# EAGLE schematic Easel_Edge_Connnector_Minimal (EAGLE 9.5.2)
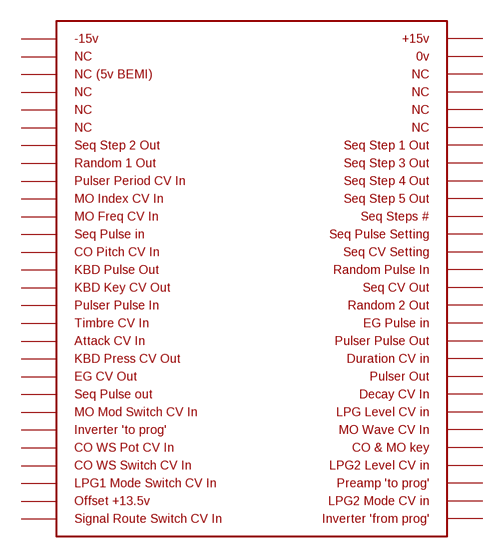
[diagram p0: schematic, sheet 1]

## Parts
U$1  EASEL_EDGESMALL  [EASEL_EDGE_SMALL]
Unconnected: U$1.B$1 U$1.B$2 U$1.B$3 U$1.B$4 U$1.B$5 U$1.B$6 U$1.B$7 U$1.B$8 U$1.B$9 U$1.B$10 U$1.B$11 U$1.B$12 U$1.B$13 U$1.B$14 U$1.B$15 U$1.B$16 U$1.B$17 U$1.B$18 U$1.B$19 U$1.B$20 U$1.B$21 U$1.B$22 U$1.B$23 U$1.B$24 U$1.B$25 U$1.B$26 U$1.B$27 U$1.B$28 U$1.F$1 U$1.F$2 U$1.F$3 U$1.F$4 U$1.F$5 U$1.F$6 U$1.F$7 U$1.F$8 U$1.F$9 U$1.F$10 U$1.F$11 U$1.F$12 U$1.F$13 U$1.F$14 U$1.F$15 U$1.F$16 U$1.F$17 U$1.F$18 U$1.F$19 U$1.F$20 U$1.F$21 U$1.F$22 U$1.F$23 U$1.F$24 U$1.F$25 U$1.F$26 U$1.F$27 U$1.F$28

## Library data of the parts
U$1 = Easel_Edge_Connector:EASEL_EDGE